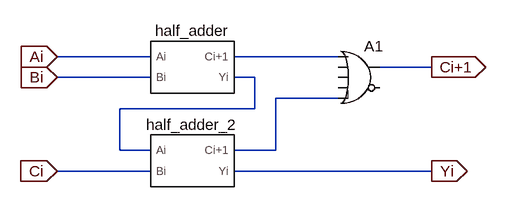
[diagram p0: schematic fulladder.asc]
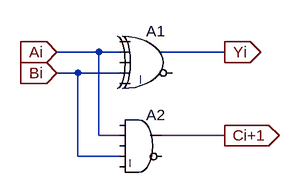
[diagram p1: sub-circuit halfadder.asc]
fulladder.asc, the LTspice schematic file:
Version 4
SHEET 1 880 680
WIRE 144 176 0 176
WIRE 432 176 272 176
WIRE 576 192 496 192
WIRE 144 208 0 208
WIRE 304 208 272 208
WIRE 432 240 336 240
WIRE 304 256 304 208
WIRE 304 256 96 256
WIRE 96 320 96 256
WIRE 144 320 96 320
WIRE 336 320 336 240
WIRE 336 320 272 320
WIRE 144 352 0 352
WIRE 576 352 272 352
FLAG 0 176 Ai
IOPIN 0 176 In
FLAG 0 208 Bi
IOPIN 0 208 In
FLAG 576 192 Ci+1
IOPIN 576 192 Out
FLAG 0 352 Ci
IOPIN 0 352 In
FLAG 576 352 Yi
IOPIN 576 352 Out
SYMBOL halfadder 208 192 R0
SYMATTR InstName half_adder
SYMBOL halfadder 208 336 R0
SYMATTR InstName half_adder_2
SYMBOL Digital\\or 464 144 R0
SYMATTR InstName A1

halfadder.asc, the sub-circuit schematic file:
Version 4
SHEET 1 880 680
WIRE 112 176 48 176
WIRE 144 176 112 176
WIRE 304 176 208 176
WIRE 80 208 48 208
WIRE 144 208 80 208
WIRE 112 304 112 176
WIRE 144 304 112 304
WIRE 304 304 208 304
WIRE 80 336 80 208
WIRE 144 336 80 336
FLAG 48 176 Ai
IOPIN 48 176 In
FLAG 48 208 Bi
IOPIN 48 208 In
FLAG 304 176 Yi
IOPIN 304 176 Out
FLAG 304 304 Ci+1
IOPIN 304 304 Out
SYMBOL Digital\\xor 192 128 R0
SYMATTR InstName A1
SYMBOL Digital\\and 176 256 R0
SYMATTR InstName A2

The netlist it stands for:
* fulladder.asc
Xhalf_adder Ai Bi N001 N002 halfadder params: halfadder
Xhalf_adder_2 N002 Ci N003 Yi halfadder params: halfadder
A1 N001 0 0 0 N003 0 Ci+1 0 OR

* block symbol definitions
.subckt halfadder Ai Bi Ci+1 Yi
A1 0 Ai 0 Bi 0 0 Yi 0 XOR
A2 0 Ai 0 Bi 0 0 Ci+1 0 AND
.ends halfadder

.backanno
.end